# EAGLE schematic OASIS-Board (EAGLE 9.6.2)

## Sheet 1 of 2: Microcontroller
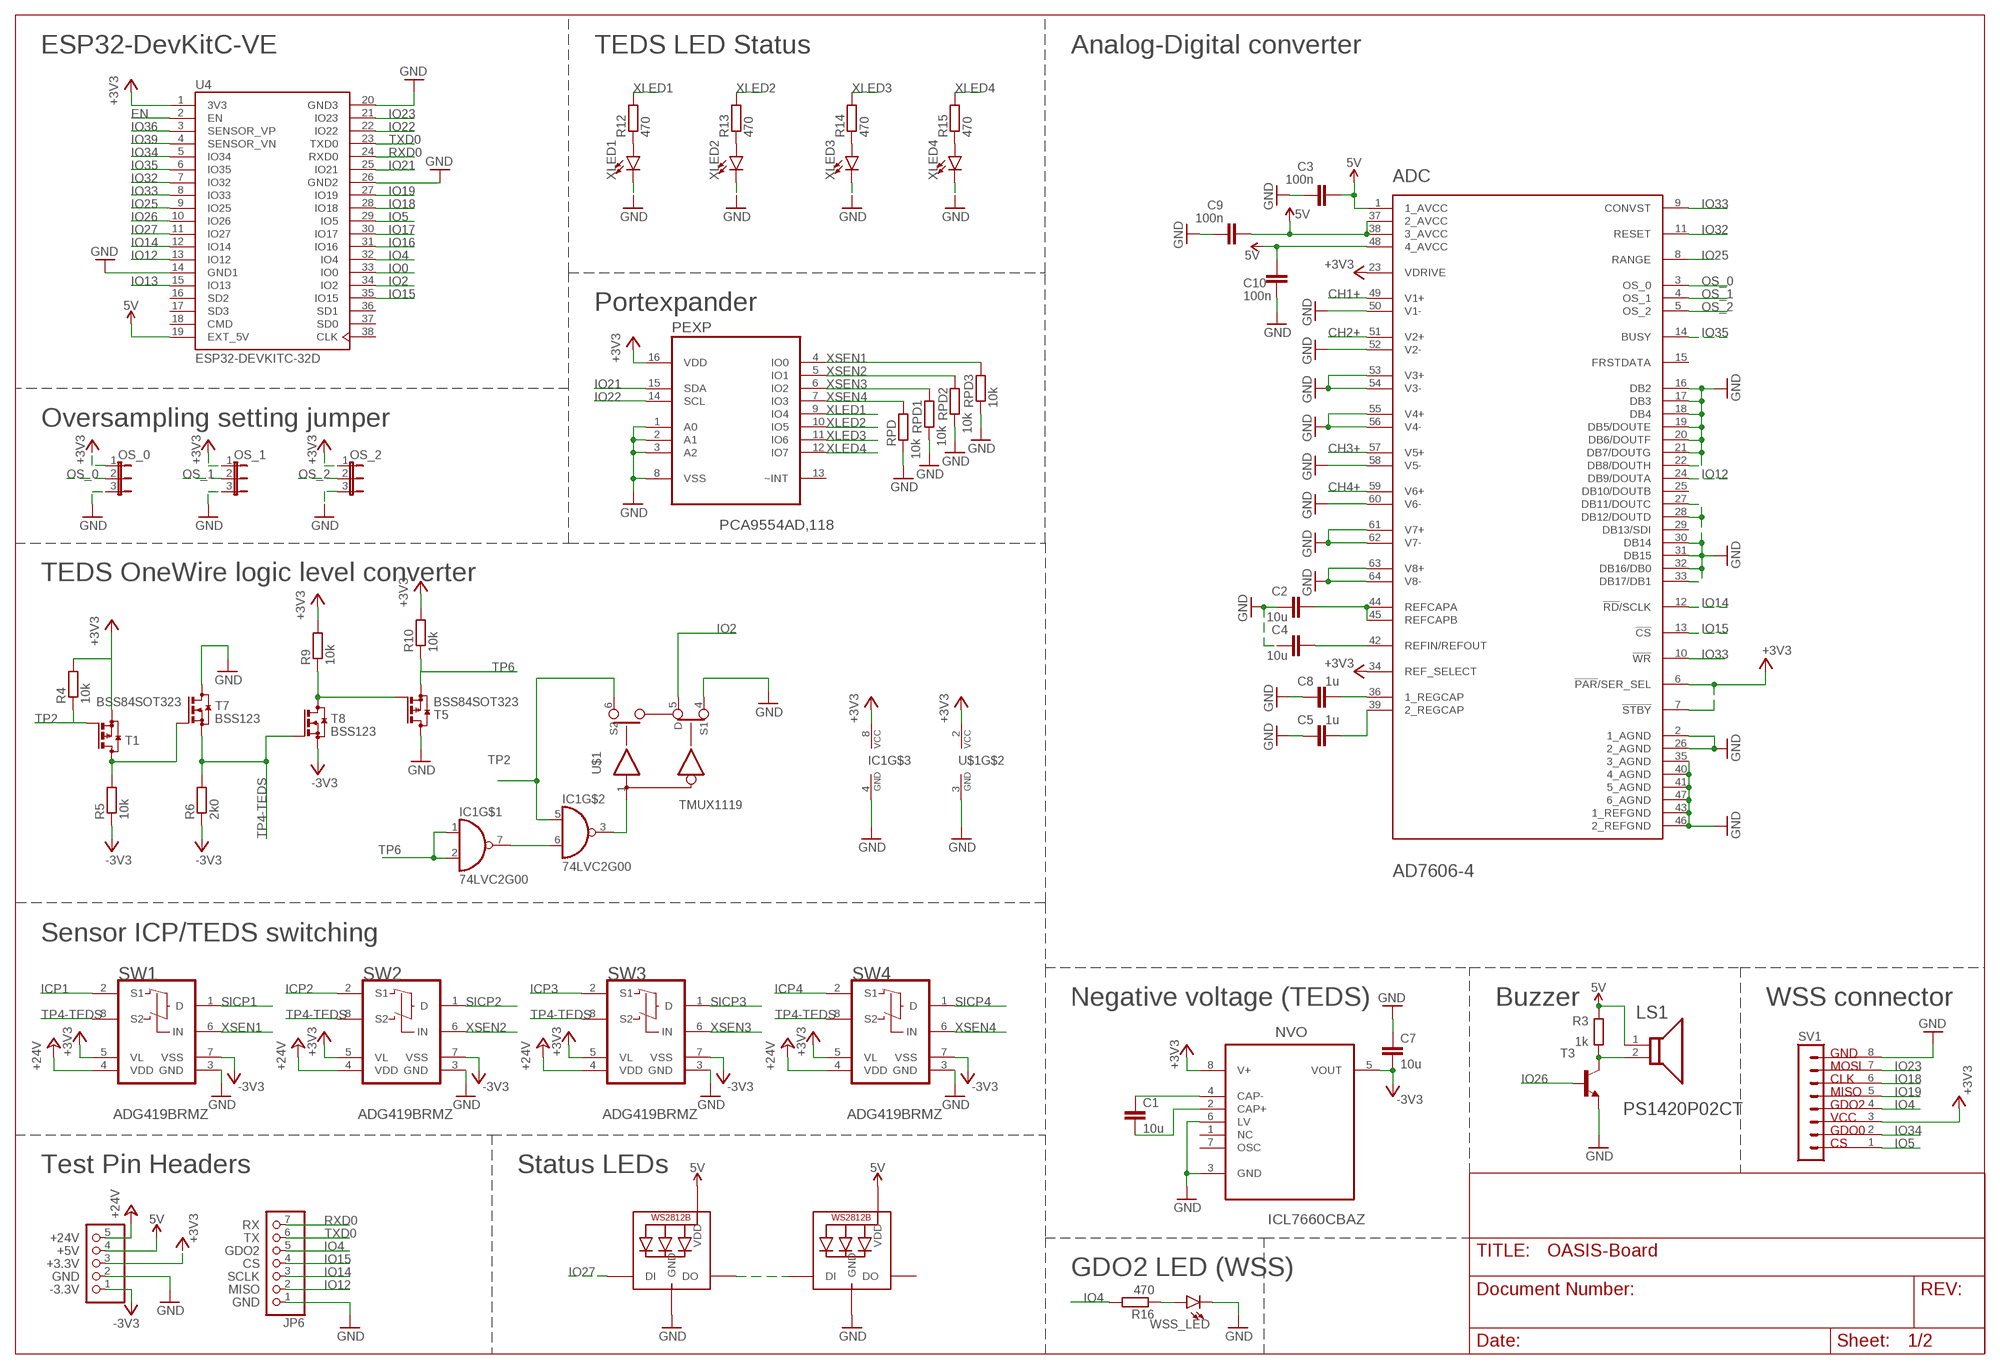
[diagram p0: schematic, sheet 1]

### Parts
ADC  ANALOG_DEVICES_AD7606-4ANALOG_DEVICES_AD7606-4_0_0  [ANALOG_DEVICES_AD7606-4_0]
C1  10u  C-EUC0603  [C0603]
C2  10u  C-EUC0603  [C0603]
C3  100n  C-EUC0603  [C0603]
C4  10u  C-EUC0603  [C0603]
C5  1u  C-EUC0603  [C0603]
C7  10u  C-EUC0603  [C0603]
C8  1u  C-EUC0603  [C0603]
C9  100n  C-EUC0603  [C0603]
C10  100n  C-EUC0603  [C0603]
IC1  74LVC2G00  [TEXAS_INSTRUMENTS_SN74LVC2G00DCUT_2]
JP5  PINHD-1X5  [1X05]
JP6  PINHD-1X7  [1X07]
LS1  TDK_PS1420P02CTTDK_PS1420P02CT_0_0  [TDK_PS1420P02CT_0]
NVO  ICL7660CBAZ  [SOIC127P600X175-8N]
OS_0  JP2E  [JP2]
OS_1  JP2E  [JP2]
OS_2  JP2E  [JP2]
PEXP  PCA9554AD,118  [SOIC127P1032X265-16N]
R3  1k  R-EU_R0603  [R0603]
R4  10k  R-EU_R0603_MAYR  [R0603_MAYR]
R5  10k  R-EU_R0603_MAYR  [R0603_MAYR]
R6  2k0  R-EU_R0603_MAYR  [R0603_MAYR]
R9  10k  R-EU_R0603_MAYR  [R0603_MAYR]
R10  10k  R-EU_R0603_MAYR  [R0603_MAYR]
R12  470  R-EU_R0603  [R0603]
R13  470  R-EU_R0603  [R0603]
R14  470  R-EU_R0603  [R0603]
R15  470  R-EU_R0603  [R0603]
R16  470  R-EU_R0603  [R0603]
RPD  10k  R-EU_R0603  [R0603]
RPD1  10k  R-EU_R0603  [R0603]
RPD2  10k  R-EU_R0603  [R0603]
RPD3  10k  R-EU_R0603  [R0603]
STATUS  WS2812B5050  [WS2812B]
SV1  MA08-1  [MA08-1]
SW1  ANALOG_DEVICES_ADG419BRMZANALOG_DEVICES_ADG419BRMZ_0_0  [ANALOG_DEVICES_ADG419BRMZ_0]
SW2  ANALOG_DEVICES_ADG419BRMZANALOG_DEVICES_ADG419BRMZ_0_0  [ANALOG_DEVICES_ADG419BRMZ_0]
SW3  ANALOG_DEVICES_ADG419BRMZANALOG_DEVICES_ADG419BRMZ_0_0  [ANALOG_DEVICES_ADG419BRMZ_0]
SW4  ANALOG_DEVICES_ADG419BRMZANALOG_DEVICES_ADG419BRMZ_0_0  [ANALOG_DEVICES_ADG419BRMZ_0]
T1  BSS84SOT323  [SOT323]
T3  BCF32-NPN-SOT23-BEC  [SOT23-BEC]
T5  BSS84SOT323  [SOT323]
T7  BSS123  [SOT23]
T8  BSS123  [SOT23]
U4  ESP32-DEVKITC-32D  [MODULE_ESP32-DEVKITC-32D]
U$1  TMUX1119  [TEXAS_INSTRUMENTS_TMUX1119DCKR_3]
WLAN  WS2812B5050  [WS2812B]
WSS_LED  LED0603  [LED-0603]
XLED1  LED0603  [LED-0603]
XLED2  LED0603  [LED-0603]
XLED3  LED0603  [LED-0603]
XLED4  LED0603  [LED-0603]

### Nets
5V: ADC.1(1_AVCC) ADC.37(2_AVCC) ADC.38(3_AVCC) ADC.48(4_AVCC) C3.2 C9.2 C10.2 JP5.4 LS1.1 R3.2 STATUS.1-VDD(VDD) U4.19(EXT_5V) WLAN.1-VDD(VDD) ; also sheet 2
+3V3: ADC.6(!PAR!/SER_SEL) ADC.7(!STBY!) ADC.23(VDRIVE) ADC.34(REF_SELECT) IC1.8(VCC) JP5.3 NVO.8(V+) OS_0.1 OS_1.1 OS_2.1 PEXP.16(VDD) R4.2 R9.2 R10.2 SV1.3 SW1.5(VL) SW2.5(VL) SW3.5(VL) SW4.5(VL) T1.3(S) U4.1(3V3) U$1.2(VCC)
+24V: JP5.5 SW1.4(VDD) SW2.4(VDD) SW3.4(VDD) SW4.4(VDD) ; also sheet 2
CH1+: ADC.49(V1+) ; also sheet 2
CH2+: ADC.51(V2+) ; also sheet 2
CH3+: ADC.57(V5+) ; also sheet 2
CH4+: ADC.59(V6+) ; also sheet 2
EN: U4.2(EN)
GND [gnd]: ADC.2(1_AGND) ADC.16(DB2) ADC.17(DB3) ADC.18(DB4) ADC.19(DB5/DOUTE) ADC.20(DB6/DOUTF) ADC.21(DB7/DOUTG) ADC.22(DB8/DOUTH) ADC.26(2_AGND) ADC.27(DB11/DOUTC) ADC.28(DB12/DOUTD) ADC.30(DB14) ADC.31(DB15) ADC.32(DB16/DB0) ADC.33(DB17/DB1) ADC.35(3_AGND) ADC.40(4_AGND) ADC.41(5_AGND) ADC.43(1_REFGND) ADC.46(2_REFGND) ADC.47(6_AGND) ADC.50(V1-) ADC.52(V2-) ADC.53(V3+) ADC.54(V3-) ADC.55(V4+) ADC.56(V4-) ADC.58(V5-) ADC.60(V6-) ADC.61(V7+) ADC.62(V7-) ADC.63(V8+) ADC.64(V8-) C2.1 C3.1 C4.1 C5.1 C7.1 C8.1 C9.1 C10.1 IC1.4(GND) JP5.2 JP6.1 NVO.3(GND) NVO.6(LV) OS_0.3 OS_1.3 OS_2.3 PEXP.1(A0) PEXP.2(A1) PEXP.3(A2) PEXP.8(VSS) RPD1.1 RPD2.1 RPD3.1 RPD.1 STATUS.3-GND(GND) SV1.8 SW1.3(GND) SW2.3(GND) SW3.3(GND) SW4.3(GND) T3.E T5.1(D) T7.3(D) U4.14(GND1) U4.20(GND3) U4.26(GND2) U$1.3(GND) U$1.4(S1) WLAN.3-GND(GND) WSS_LED.C XLED1.C XLED2.C XLED3.C XLED4.C ; also sheet 2
ICP1: SW1.2(S1) ; also sheet 2
ICP2: SW2.2(S1) ; also sheet 2
ICP3: SW3.2(S1) ; also sheet 2
ICP4: SW4.2(S1) ; also sheet 2
IO0: U4.33(IO0)
IO2: U4.34(IO2) U$1.5(D)
IO4: JP6.5 R16.2 SV1.4 U4.32(IO4)
IO5: SV1.1 U4.29(IO5)
IO12: ADC.24(DB9/DOUTA) JP6.2 U4.13(IO12)
IO13: U4.15(IO13)
IO14: ADC.12(!RD!/SCLK) JP6.3 U4.12(IO14)
IO15: ADC.13(!CS!) JP6.4 U4.35(IO15)
IO16: U4.31(IO16)
IO17: U4.30(IO17)
IO18: SV1.6 U4.28(IO18)
IO19: SV1.5 U4.27(IO19)
IO21: PEXP.15(SDA) U4.25(IO21)
IO22: PEXP.14(SCL) U4.22(IO22)
IO23: SV1.7 U4.21(IO23)
IO25: ADC.8(RANGE) U4.9(IO25)
IO26: T3.B U4.10(IO26)
IO27: STATUS.4-DIN(DI) U4.11(IO27)
IO32: ADC.11(RESET) U4.7(IO32)
IO33: ADC.9(CONVST) ADC.10(!WR!) U4.8(IO33)
IO34: SV1.2 U4.5(IO34)
IO35: ADC.14(BUSY) U4.6(IO35)
IO36: U4.3(SENSOR_VP)
IO39: U4.4(SENSOR_VN)
N$3: R16.1 WSS_LED.A
N$4: LS1.2 R3.1 T3.C
N$5: ADC.36(1_REGCAP) C8.2
N$6: STATUS.2-DOUT(DO) WLAN.4-DIN(DI)
N$7: C1.1 NVO.4(CAP-)
N$10: ADC.44(REFCAPA) ADC.45(REFCAPB) C2.2
N$11: R9.1 T5.2(G) T8.3(D)
N$12: IC1.3(O) U$1.1(IN)
N$13: ADC.39(2_REGCAP) C5.2
N$20: IC1.6(I1) IC1.7(O)
N$21: R5.2 T1.1(D) T7.1(G)
N$22: C1.2 NVO.2(CAP+)
N$23: R12.1 XLED1.A
N$24: R13.1 XLED2.A
N$30: ADC.42(REFIN/REFOUT) C4.2
N$33: R14.1 XLED3.A
N$36: R15.1 XLED4.A
OS_0: ADC.3(OS_0) OS_0.2
OS_1: ADC.4(OS_1) OS_1.2
OS_2: ADC.5(OS_2) OS_2.2
RXD0: JP6.7 U4.24(RXD0)
SICP1: SW1.1(D) ; also sheet 2
SICP2: SW2.1(D) ; also sheet 2
SICP3: SW3.1(D) ; also sheet 2
SICP4: SW4.1(D) ; also sheet 2
TP2: IC1.5(I0) R4.1 T1.2(G) U$1.6(S2)
TP4-TEDS: R6.2 SW1.8(S2) SW2.8(S2) SW3.8(S2) SW4.8(S2) T7.2(S) T8.1(G)
TP6: IC1.1(I0) IC1.2(I1) R10.1 T5.3(S)
TXD0: JP6.6 U4.23(TXD0)
V-: C7.2 JP5.1 NVO.5(VOUT) R5.1 R6.1 SW1.7(VSS) SW2.7(VSS) SW3.7(VSS) SW4.7(VSS) T8.2(S) ; supply symbol labelled -3V3
XLED1: PEXP.9(IO4) R12.2
XLED2: PEXP.10(IO5) R13.2
XLED3: PEXP.11(IO6) R14.2
XLED4: PEXP.12(IO7) R15.2
XSEN1: PEXP.4(IO0) RPD3.2 SW1.6(IN)
XSEN2: PEXP.5(IO1) RPD2.2 SW2.6(IN)
XSEN3: PEXP.6(IO2) RPD1.2 SW3.6(IN)
XSEN4: PEXP.7(IO3) RPD.2 SW4.6(IN)
Unconnected: ADC.15(FRSTDATA) ADC.25(DB10/DOUTB) ADC.29(DB13/SDI) NVO.1(NC) NVO.7(OSC) PEXP.13(~INT) U4.16(SD2) U4.17(SD3) U4.18(CMD) U4.36(SD1) U4.37(SD0) U4.38(CLK) WLAN.2-DOUT(DO)

### Notes on the sheet
- ESP32-DevKitC-VE | TEDS LED Status | Analog-Digital converter
- Portexpander
- Oversampling setting jumper
- TEDS OneWire logic level converter
- Sensor ICP/TEDS switching
- Negative voltage (TEDS) | Buzzer | WSS connector
- Test Pin Headers | Status LEDs
- GDO2 LED (WSS)

## Sheet 2 of 2: IEPE-Modul
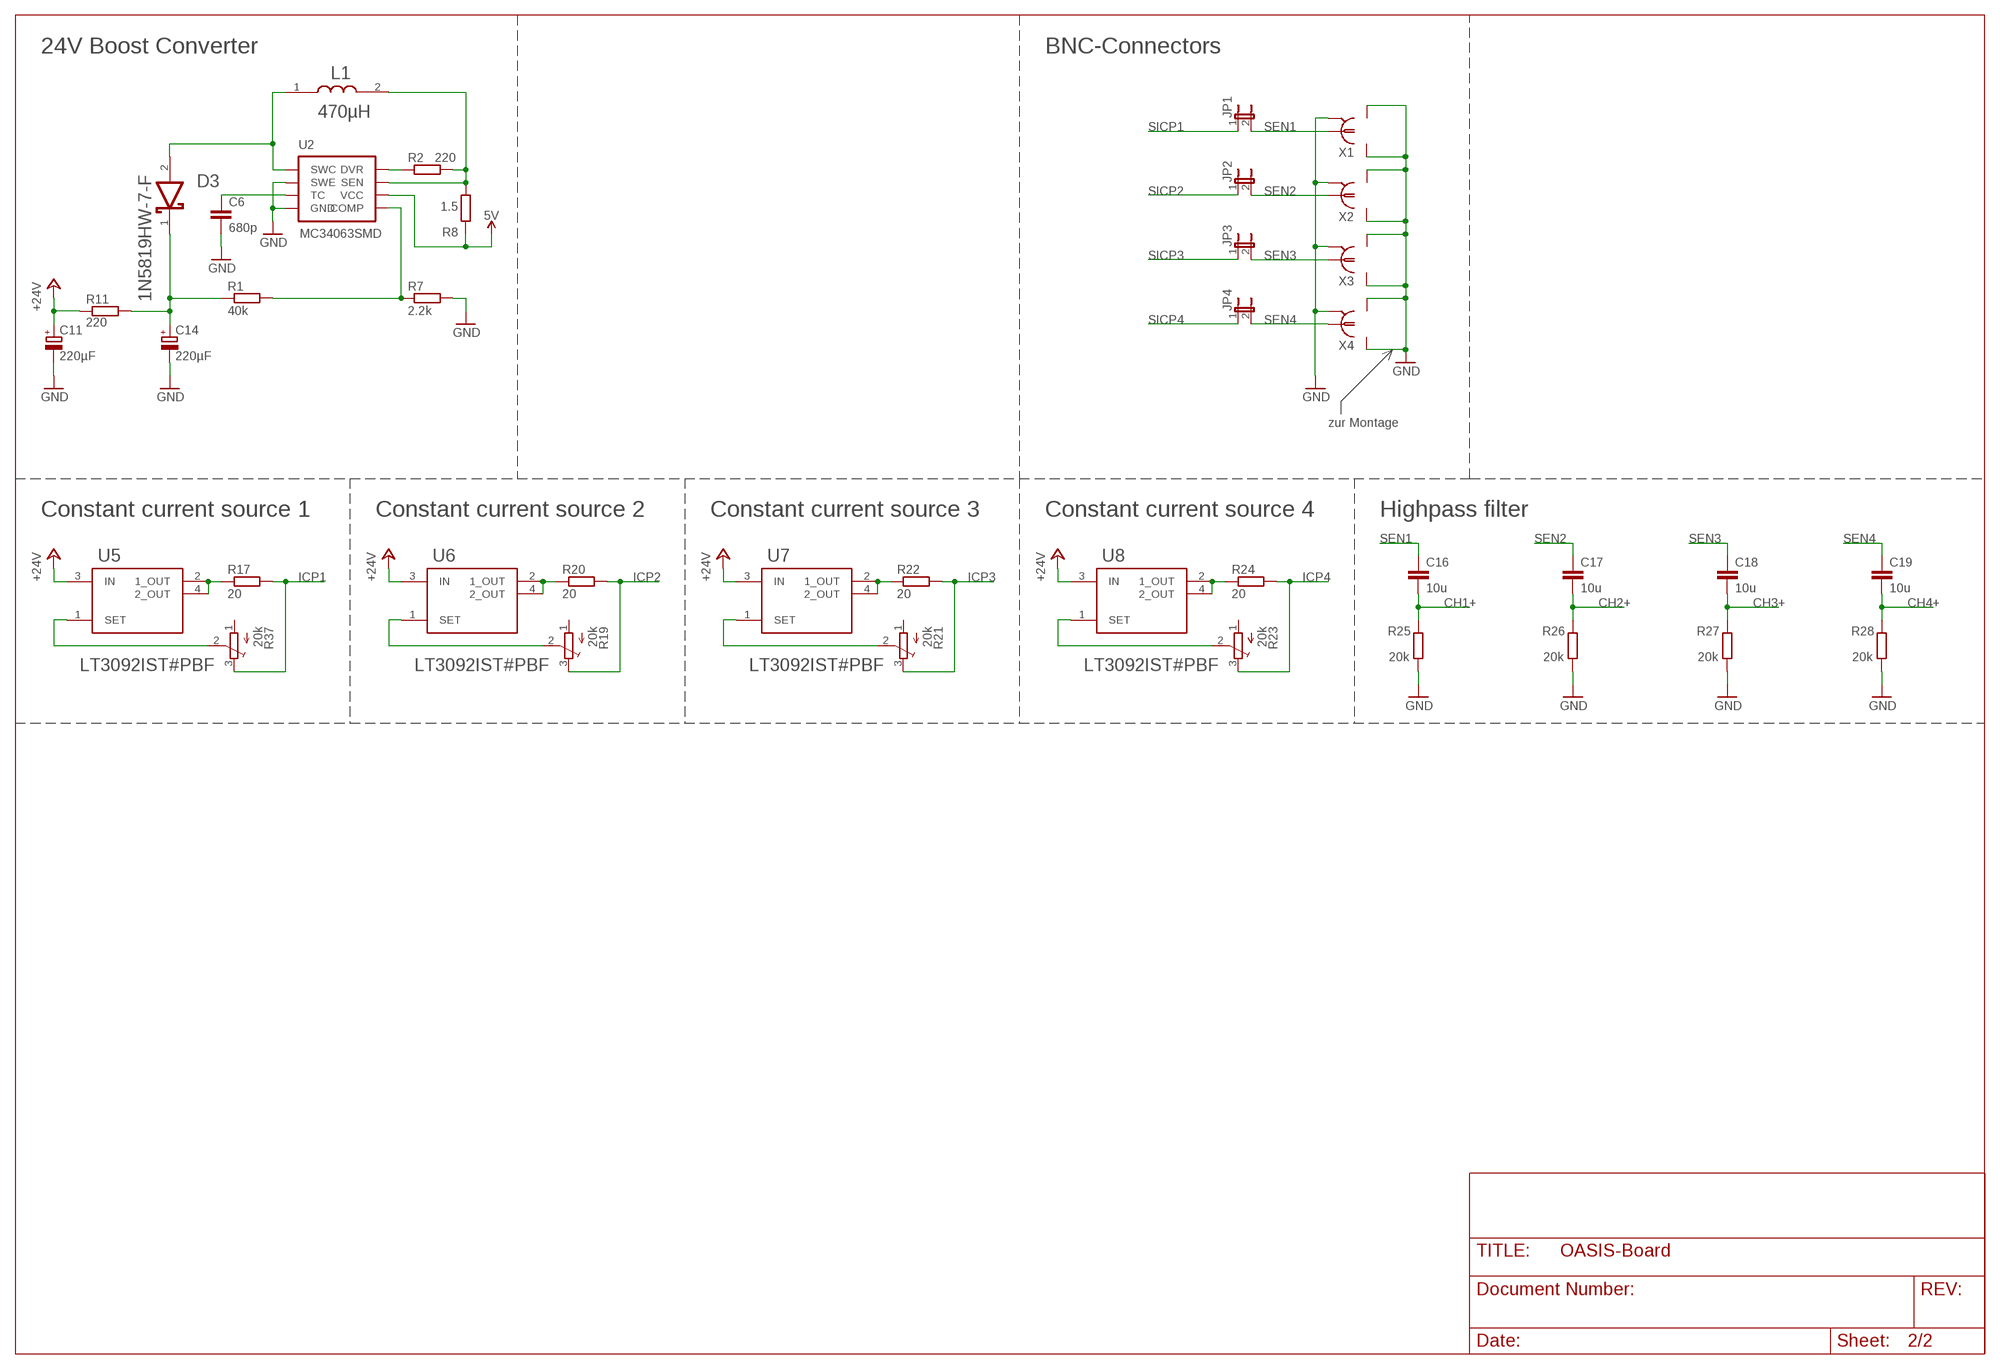
[diagram p1: schematic, sheet 2]

### Parts
C6  680p  C-EUC0603  [C0603]
C11  220µF  CPOL-EU153CLV-1012  [153CLV-1012]
C14  220µF  CPOL-EU153CLV-1012  [153CLV-1012]
C16  10u  C-EUC0603  [C0603]
C17  10u  C-EUC0603  [C0603]
C18  10u  C-EUC0603  [C0603]
C19  10u  C-EUC0603  [C0603]
D3  DIODES_1N5819HW-7-FDIODES_1N5819HW-7-F_0_1  [DIODES_1N5819HW-7-F_1]
JP1  JP1E  [JP1]
JP2  JP1E  [JP1]
JP3  JP1E  [JP1]
JP4  JP1E  [JP1]
L1  BOURNS_SRR1260-470MBOURNS_SRR1260-470M_0_0  [BOURNS_SRR1260-470M_0]
R1  40k  R-EU_R0603  [R0603]
R2  220  R-EU_R0603  [R0603]
R7  2.2k  R-EU_R0603  [R0603]
R8  1.5  R-EU_R0603  [R0603]
R11  220  R-EU_R0603  [R0603]
R17  20  R-EU_R0603  [R0603]
R19  20k  TRIM_EU-SM-42/43W  [SM-42/43W]
R20  20  R-EU_R0603  [R0603]
R21  20k  TRIM_EU-SM-42/43W  [SM-42/43W]
R22  20  R-EU_R0603  [R0603]
R23  20k  TRIM_EU-SM-42/43W  [SM-42/43W]
R24  20  R-EU_R0603  [R0603]
R25  20k  R-EU_R0603  [R0603]
R26  20k  R-EU_R0603  [R0603]
R27  20k  R-EU_R0603  [R0603]
R28  20k  R-EU_R0603  [R0603]
R37  20k  TRIM_EU-SM-42/43W  [SM-42/43W]
U2  MC34063SMD  [SO08]
U5  ANALOG_DEVICES_INC_LT3092IST#PBFANALOG_DEVICES_INC_LT3092IST#PBF_0_0  [ANALOG_DEVICES_INC_LT3092IST#PBF_0]
U6  ANALOG_DEVICES_INC_LT3092IST#PBFANALOG_DEVICES_INC_LT3092IST#PBF_0_0  [ANALOG_DEVICES_INC_LT3092IST#PBF_0]
U7  ANALOG_DEVICES_INC_LT3092IST#PBFANALOG_DEVICES_INC_LT3092IST#PBF_0_0  [ANALOG_DEVICES_INC_LT3092IST#PBF_0]
U8  ANALOG_DEVICES_INC_LT3092IST#PBFANALOG_DEVICES_INC_LT3092IST#PBF_0_0  [ANALOG_DEVICES_INC_LT3092IST#PBF_0]
X1  BNC  [AMP_227161]
X2  BNC  [AMP_227161]
X3  BNC  [AMP_227161]
X4  BNC  [AMP_227161]

### Nets
5V: R8.1 U2.6(VCC) ; also sheet 1
+24V: C11.+ R11.1 U5.3(IN) U6.3(IN) U7.3(IN) U8.3(IN) ; also sheet 1
CH1+: C16.2 R25.2 ; also sheet 1
CH2+: C17.2 R26.2 ; also sheet 1
CH3+: C18.2 R27.2 ; also sheet 1
CH4+: C19.2 R28.2 ; also sheet 1
GND [gnd]: C6.2 C11.- C14.- R7.2 R25.1 R26.1 R27.1 R28.1 U2.2(SWE) U2.4(GND) X1.2 X1.P$1 X1.P$2 X2.2 X2.P$1 X2.P$2 X3.2 X3.P$1 X3.P$2 X4.2 X4.P$1 X4.P$2 ; also sheet 1
ICP1: R17.2 R37.3(E) ; also sheet 1
ICP2: R19.3(E) R20.2 ; also sheet 1
ICP3: R21.3(E) R22.2 ; also sheet 1
ICP4: R23.3(E) R24.2 ; also sheet 1
N$14: D3.2(ANODE) L1.1 U2.1(SWC)
N$15: C6.1 U2.3(TC)
N$16: L1.2 R2.2 R8.2 U2.7(SEN)
N$17: R1.2 R7.1 U2.5(COMP)
N$18: R2.1 U2.8(DVR)
N$19: C14.+ D3.1(CATHODE) R1.1 R11.2
N$26: R17.1 U5.2(1_OUT) U5.4(2_OUT)
N$27: R37.2(S) U5.1(SET)
N$28: R20.1 U6.2(1_OUT) U6.4(2_OUT)
N$29: R19.2(S) U6.1(SET)
N$31: R22.1 U7.2(1_OUT) U7.4(2_OUT)
N$32: R21.2(S) U7.1(SET)
N$34: R24.1 U8.2(1_OUT) U8.4(2_OUT)
N$35: R23.2(S) U8.1(SET)
SEN1: C16.1 JP1.2 X1.1
SEN2: C17.1 JP2.2 X2.1
SEN3: C18.1 JP3.2 X3.1
SEN4: C19.1 JP4.2 X4.1
SICP1: JP1.1 ; also sheet 1
SICP2: JP2.1 ; also sheet 1
SICP3: JP3.1 ; also sheet 1
SICP4: JP4.1 ; also sheet 1
Unconnected: R19.1(A) R21.1(A) R23.1(A) R37.1(A)

### Notes on the sheet
- 24V Boost Converter | BNC-Connectors
- zur Montage
- Constant current source 1 | Constant current source 2 | Constant current source 3 | Constant current source 4 | Highpass filter

## Library data of the parts
ADC = AD7606-4:ANALOG_DEVICES_AD7606-4: 18 Bit Analog to Digital Converter 8 Input 1 SAR 64-LQFP (10x10); AUTOMOTIVE: No; CENTROID_NOT_SPECIFIED: No; DATASHEET: https://www.analog.com/media/en/technical-documentation/data-sheets/ad7606c-18.pdf; DATA_POLARITY: Single Ended/Differential; DEVICE_CLASS_L1: Integrated Circuits (ICs); DEVICE_CLASS_L2: Data Converter ICs; DEVICE_CLASS_L3: Analog to Digital Converters (ADCs); DIGIKEY_DESCRIPTION: IC ADC 18BIT SAR 64LQFP; DIGIKEY_PART_NUMBER: 505-AD7606-4-ND; FOOTPRINT_PARAMETERS_0: {"fp_type":"MQFP","params":{"N1":{"nom":16,"long name":"Leads on long side","min":null,"max":null,"short name":"N1","type":"count"},"N2":{"nom":16,"long name":"Leads on wide side","min":null,"max":null,"short name":"N2","type":"count"},"A":{"nom":false,"long name":"Height","min":false,"max":1600000,"short name":"A","type":"measurement"},"A1":{"nom":100000,"long name":"Package clearance","min":50000,"max":150000,"short name":"A1","type":"measurement"},"A2":{"nom":1400000,"long name":"Package height","min":1350000,"max":1450000,"short name":"A2","type":"measurement"},"D":{"nom":12000000,"long name":"Length /w leads","min":11800000,"max":12200000,"short name":"D","type":"measurement"},"D1":{"nom":10000000,"long name":"Package length","min":9800000,"max":10200000,"short name":"D1","type":"measurement"},"E":{"nom":12000000,"long name":"Width /w leads","min":11800000,"max":12200000,"short name":"E","type":"measurement"},"E1":{"nom":10000000,"long name":"Package width","min":9800000,"max":10200000,"short name":"E1","type":"measurement"},"B":{"nom":220000,"long name":"Lead width","min":170000,"max":270000,"short name":"B","type":"measurement"},"C":{"nom":145000,"long name":"Lead thickness","min":90000,"max":200000,"short name":"C","type":"measurement"},"L":{"nom":600000,"long name":"Lead foot length","min":450000,"max":750000,"short name":"L","type":"measurement"},"e":{"nom":500000,"long name":"Lead pitch","min":null,"max":null,"short name":"e","type":"measurement"},"PHI":{"nom":35,"long name":"Lead angle","min":0,"max":70,"short name":"PHI","type":"measurement"},"HT":{"default":"No","long name":"Thermal pad","type":"multichoiceparent","short name":"HT","children":[]},"offset x":{"nom":0,"long name":"X Center offset","min":null,"max":null,"short name":"offset x","type":"measurement"},"offset y":{"nom":0,"long name":"Y Center offset","min":null,"max":null,"short name":"offset y","type":"measurement"},"LS":{"default":"Rounded rectangle","long name":"Land shape","type":"multichoice","short name":"LS"},"LS1":{"default":"Rectangle","long name":"Land shape (Pin 1)","type":"multichoice","short name":"LS1"},"solder toe":{"nom":550000,"long name":"Solder fillet (toe)","min":null,"max":null,"short name":"solder toe","type":"fixedmeasurement"},"solder heel":{"nom":450000,"long name":"Solder fillet (heel)","min":null,"max":null,"short name":"solder heel","type":"fixedmeasurement"},"solder side":{"nom":10000,"long name":"Solder fillet (side)","min":null,"max":null,"short name":"solder side","type":"fixedmeasurement"},"courtyard":{"nom":500000,"long name":"Courtyard","min":null,"max":null,"short name":"courtyard","type":"fixedmeasurement"},"SF":{"default":"A (<= 0.625mm pitch)","long name":"Packing level","type":"multichoiceparent","short name":"SF","help":"http://support.upverter.com/customer/portal/articles/978783-what-is-a-footprint-packing-level","children":["solder toe","solder heel","solder side","courtyard"]}}}; FOOTPRINT_PARAMETERS_1: {"fp_type":"MQFP","params":{"N1":{"nom":16,"long name":"Leads on long side","min":null,"max":null,"short name":"N1","type":"count"},"N2":{"nom":16,"long name":"Leads on wide side","min":null,"max":null,"short name":"N2","type":"count"},"A":{"nom":false,"long name":"Height","min":false,"max":1600000,"short name":"A","type":"measurement"},"A1":{"nom":100000,"long name":"Package clearance","min":50000,"max":150000,"short name":"A1","type":"measurement"},"A2":{"nom":1400000,"long name":"Package height","min":1350000,"max":1450000,"short name":"A2","type":"measurement"},"D":{"nom":12000000,"long name":"Length /w leads","min":11800000,"max":12200000,"short name":"D","type":"measurement"},"D1":{"nom":10000000,"long name":"Package length","min":9800000,"max":10200000,"short name":"D1","type":"measurement"},"E":{"nom":12000000,"long name":"Width /w leads","min":11800000,"max":12200000,"short name":"E","type":"measurement"},"E1":{"nom":10000000,"long name":"Package width","min":9800000,"max":10200000,"short name":"E1","type":"measurement"},"B":{"nom":220000,"long name":"Lead width","min":170000,"max":270000,"short name":"B","type":"measurement"},"C":{"nom":145000,"long name":"Lead thickness","min":90000,"max":200000,"short name":"C","type":"measurement"},"L":{"nom":600000,"long name":"Lead foot length","min":450000,"max":750000,"short name":"L","type":"measurement"},"e":{"nom":500000,"long name":"Lead pitch","min":null,"max":null,"short name":"e","type":"measurement"},"PHI":{"nom":35,"long name":"Lead angle","min":0,"max":70,"short name":"PHI","type":"measurement"},"HT":{"default":"No","long name":"Thermal pad","type":"multichoiceparent","short name":"HT","children":[]},"offset x":{"nom":0,"long name":"X Center offset","min":null,"max":null,"short name":"offset x","type":"measurement"},"offset y":{"nom":0,"long name":"Y Center offset","min":null,"max":null,"short name":"offset y","type":"measurement"},"LS":{"default":"Rounded rectangle","long name":"Land shape","type":"multichoice","short name":"LS"},"LS1":{"default":"Rectangle","long name":"Land shape (Pin 1)","type":"multichoice","short name":"LS1"},"solder toe":{"nom":350000,"long name":"Solder fillet (toe)","min":null,"max":null,"short name":"solder toe","type":"fixedmeasurement"},"solder heel":{"nom":350000,"long name":"Solder fillet (heel)","min":null,"max":null,"short name":"solder heel","type":"fixedmeasurement"},"solder side":{"nom":-20000,"long name":"Solder fillet (side)","min":null,"max":null,"short name":"solder side","type":"fixedmeasurement"},"courtyard":{"nom":250000,"long name":"Courtyard","min":null,"max":null,"short name":"courtyard","type":"fixedmeasurement"},"SF":{"default":"B (<= 0.625mm pitch)","long name":"Packing level","type":"multichoiceparent","short name":"SF","help":"http://support.upverter.com/customer/portal/articles/978783-what-is-a-footprint-packing-level","children":["solder toe","solder heel","solder side","courtyard"]}}}; FOOTPRINT_PARAMETERS_2: {"fp_type":"MQFP","params":{"N1":{"nom":16,"long name":"Leads on long side","min":null,"max":null,"short name":"N1","type":"count"},"N2":{"nom":16,"long name":"Leads on wide side","min":null,"max":null,"short name":"N2","type":"count"},"A":{"nom":false,"long name":"Height","min":false,"max":1600000,"short name":"A","type":"measurement"},"A1":{"nom":100000,"long name":"Package clearance","min":50000,"max":150000,"short name":"A1","type":"measurement"},"A2":{"nom":1400000,"long name":"Package height","min":1350000,"max":1450000,"short name":"A2","type":"measurement"},"D":{"nom":12000000,"long name":"Length /w leads","min":11800000,"max":12200000,"short name":"D","type":"measurement"},"D1":{"nom":10000000,"long name":"Package length","min":9800000,"max":10200000,"short name":"D1","type":"measurement"},"E":{"nom":12000000,"long name":"Width /w leads","min":11800000,"max":12200000,"short name":"E","type":"measurement"},"E1":{"nom":10000000,"long name":"Package width","min":9800000,"max":10200000,"short name":"E1","type":"measurement"},"B":{"nom":220000,"long name":"Lead width","min":170000,"max":270000,"short name":"B","type":"measurement"},"C":{"nom":145000,"long name":"Lead thickness","min":90000,"max":200000,"short name":"C","type":"measurement"},"L":{"nom":600000,"long name":"Lead foot length","min":450000,"max":750000,"short name":"L","type":"measurement"},"e":{"nom":500000,"long name":"Lead pitch","min":null,"max":null,"short name":"e","type":"measurement"},"PHI":{"nom":35,"long name":"Lead angle","min":0,"max":70,"short name":"PHI","type":"measurement"},"HT":{"default":"No","long name":"Thermal pad","type":"multichoiceparent","short name":"HT","children":[]},"offset x":{"nom":0,"long name":"X Center offset","min":null,"max":null,"short name":"offset x","type":"measurement"},"offset y":{"nom":0,"long name":"Y Center offset","min":null,"max":null,"short name":"offset y","type":"measurement"},"LS":{"default":"Rounded rectangle","long name":"Land shape","type":"multichoice","short name":"LS"},"LS1":{"default":"Rectangle","long name":"Land shape (Pin 1)","type":"multichoice","short name":"LS1"},"solder toe":{"nom":150000,"long name":"Solder fillet (toe)","min":null,"max":null,"short name":"solder toe","type":"fixedmeasurement"},"solder heel":{"nom":250000,"long name":"Solder fillet (heel)","min":null,"max":null,"short name":"solder heel","type":"fixedmeasurement"},"solder side":{"nom":-40000,"long name":"Solder fillet (side)","min":null,"max":null,"short name":"solder side","type":"fixedmeasurement"},"courtyard":{"nom":100000,"long name":"Courtyard","min":null,"max":null,"short name":"courtyard","type":"fixedmeasurement"},"SF":{"default":"C (<= 0.625mm pitch)","long name":"Packing level","type":"multichoiceparent","short name":"SF","help":"http://support.upverter.com/customer/portal/articles/978783-what-is-a-footprint-packing-level","children":["solder toe","solder heel","solder side","courtyard"]}}}; FOOTPRINT_URL: https://www.analog.com/media/en/package-pcb-resources/package/pkg_pdf/lqfpst/st_64_2.pdf; FOOTPRINT_VARIANT_NAME_0: IPC_A; FOOTPRINT_VARIANT_NAME_1: IPC_B; FOOTPRINT_VARIANT_NAME_2: IPC_C; HEIGHT: 1.6mm; INTERFACE: SPI,Parallel; LEAD_FREE: Yes; MAX_JUNCTION_TEMP: +150°C; MAX_SUPPLY_VOLTAGE: 5.25V; MF: Analog Devices; MFG_PACKAGE_IDENT: ST-64-2; MFG_PACKAGE_IDENT_COMPONENT_ID: 9cd505c2a9c114eb; MFG_PACKAGE_IDENT_DATE: 05/2006; MFG_PACKAGE_IDENT_REV: A; MIN_SUPPLY_VOLTAGE: 1.71V; MOUSER_PART_NUMBER: 584-AD7606-4; MPN: AD7606-4; NOMINAL_SUPPLY_CURRENT: 8-45mA; NUMBER_OF_CHANNELS: 8; NUMBER_OF_CONVERTERS: 1; PACKAGE: LQFP64; PREFIX: U; RESOLUTION: 18bits; ROHS: Yes; SAMPLING_RATE: 1Msps; STANDOFF_HEIGHT: 0.05mm; TEMPERATURE_RANGE_HIGH: +125°C; TEMPERATURE_RANGE_LOW: -40°C; VERIFICATION_VERSION: 0.0.0.3
C1-C10 C16-C19 = rcl:C-EU: CAPACITOR, European symbol; SPICEPREFIX: C
C11 C14 = rcl:CPOL-EU: POLARIZED CAPACITOR, European symbol; SPICEPREFIX: C
D3 = Diodes - 1N5819HW-7-F:DIODES_1N5819HW-7-F: Diode Schottky 40V 1A Surface Mount SOD-123; AUTOMOTIVE: No; CAPACITANCE: 50pF; CENTROID_NOT_SPECIFIED: No; DATASHEET: https://www.diodes.com/assets/Datasheets/ds30217.pdf; DEVICE_CLASS_L1: Discrete Semiconductors; DEVICE_CLASS_L2: Diodes; DEVICE_CLASS_L3: Schottky Diodes; DIGIKEY_DESCRIPTION: DIODE SCHOTTKY 40V 1A SOD123; DIGIKEY_PART_NUMBER: 1N5819HW-FDICT-ND; FOOTPRINT_PARAMETERS_1: {"fp_type":"SOD123","params":{"N":{"long name":"Number of leads","type":"fixed","short name":"N","value":2},"A":{"nom":1100000,"long name":"Height","min":1000000,"max":1450000,"short name":"A","type":"measurement"},"A1":{"nom":50000,"long name":"Package clearance","min":0,"max":100000,"short name":"A1","type":"measurement"},"A2":{"nom":false,"long name":"Package height","min":false,"max":1450000,"short name":"A2","type":"measurement"},"D":{"nom":3650000,"long name":"Length /w leads","min":3550000,"max":3850000,"short name":"D","type":"measurement"},"D1":{"nom":2650000,"long name":"Package length","min":2550000,"max":2850000,"short name":"D1","type":"measurement"},"E":{"nom":1550000,"long name":"Package width","min":1400000,"max":1700000,"short name":"E","type":"measurement"},"B":{"nom":570000,"long name":"Lead width","min":520000,"max":620000,"short name":"B","type":"measurement"},"C":{"nom":110000,"long name":"Lead thickness","min":100000,"max":150000,"short name":"C","type":"measurement"},"L":{"nom":300000,"long name":"Lead foot length","min":250000,"max":400000,"short name":"L","type":"measurement"},"PHI":{"nom":false,"long name":"Lead angle","min":0,"max":8000000,"short name":"PHI","type":"measurement"},"offset x":{"nom":0,"long name":"X Center offset","min":null,"max":null,"short name":"offset x","type":"measurement"},"offset y":{"nom":0,"long name":"Y Center offset","min":null,"max":null,"short name":"offset y","type":"measurement"},"LS":{"default":"Rounded rectangle","long name":"Land shape","type":"multichoice","short name":"LS"},"LS1":{"default":"Rectangle","long name":"Land shape (Pin 1)","type":"multichoice","short name":"LS1"},"solder toe":{"nom":550000,"long name":"Solder fillet (toe)","min":null,"max":null,"short name":"solder toe","type":"fixedmeasurement"},"solder heel":{"nom":450000,"long name":"Solder fillet (heel)","min":null,"max":null,"short name":"solder heel","type":"fixedmeasurement"},"solder side":{"nom":50000,"long name":"Solder fillet (side)","min":null,"max":null,"short name":"solder side","type":"fixedmeasurement"},"courtyard":{"nom":500000,"long name":"Courtyard","min":null,"max":null,"short name":"courtyard","type":"fixedmeasurement"},"SF":{"default":"A","long name":"Packing level","type":"multichoiceparent","short name":"SF","help":"http://support.upverter.com/customer/portal/articles/978783-what-is-a-footprint-packing-level","children":["solder toe","solder heel","solder side","courtyard"]}}}; FOOTPRINT_PARAMETERS_2: {"fp_type":"SOD123","params":{"N":{"long name":"Number of leads","type":"fixed","short name":"N","value":2},"A":{"nom":1100000,"long name":"Height","min":1000000,"max":1450000,"short name":"A","type":"measurement"},"A1":{"nom":50000,"long name":"Package clearance","min":0,"max":100000,"short name":"A1","type":"measurement"},"A2":{"nom":false,"long name":"Package height","min":false,"max":1450000,"short name":"A2","type":"measurement"},"D":{"nom":3650000,"long name":"Length /w leads","min":3550000,"max":3850000,"short name":"D","type":"measurement"},"D1":{"nom":2650000,"long name":"Package length","min":2550000,"max":2850000,"short name":"D1","type":"measurement"},"E":{"nom":1550000,"long name":"Package width","min":1400000,"max":1700000,"short name":"E","type":"measurement"},"B":{"nom":570000,"long name":"Lead width","min":520000,"max":620000,"short name":"B","type":"measurement"},"C":{"nom":110000,"long name":"Lead thickness","min":100000,"max":150000,"short name":"C","type":"measurement"},"L":{"nom":300000,"long name":"Lead foot length","min":250000,"max":400000,"short name":"L","type":"measurement"},"PHI":{"nom":false,"long name":"Lead angle","min":0,"max":8000000,"short name":"PHI","type":"measurement"},"offset x":{"nom":0,"long name":"X Center offset","min":null,"max":null,"short name":"offset x","type":"measurement"},"offset y":{"nom":0,"long name":"Y Center offset","min":null,"max":null,"short name":"offset y","type":"measurement"},"LS":{"default":"Rounded rectangle","long name":"Land shape","type":"multichoice","short name":"LS"},"LS1":{"default":"Rectangle","long name":"Land shape (Pin 1)","type":"multichoice","short name":"LS1"},"solder toe":{"nom":350000,"long name":"Solder fillet (toe)","min":null,"max":null,"short name":"solder toe","type":"fixedmeasurement"},"solder heel":{"nom":350000,"long name":"Solder fillet (heel)","min":null,"max":null,"short name":"solder heel","type":"fixedmeasurement"},"solder side":{"nom":30000,"long name":"Solder fillet (side)","min":null,"max":null,"short name":"solder side","type":"fixedmeasurement"},"courtyard":{"nom":250000,"long name":"Courtyard","min":null,"max":null,"short name":"courtyard","type":"fixedmeasurement"},"SF":{"default":"B","long name":"Packing level","type":"multichoiceparent","short name":"SF","help":"http://support.upverter.com/customer/portal/articles/978783-what-is-a-footprint-packing-level","children":["solder toe","solder heel","solder side","courtyard"]}}}; FOOTPRINT_PARAMETERS_3: {"fp_type":"SOD123","params":{"N":{"long name":"Number of leads","type":"fixed","short name":"N","value":2},"A":{"nom":1100000,"long name":"Height","min":1000000,"max":1450000,"short name":"A","type":"measurement"},"A1":{"nom":50000,"long name":"Package clearance","min":0,"max":100000,"short name":"A1","type":"measurement"},"A2":{"nom":false,"long name":"Package height","min":false,"max":1450000,"short name":"A2","type":"measurement"},"D":{"nom":3650000,"long name":"Length /w leads","min":3550000,"max":3850000,"short name":"D","type":"measurement"},"D1":{"nom":2650000,"long name":"Package length","min":2550000,"max":2850000,"short name":"D1","type":"measurement"},"E":{"nom":1550000,"long name":"Package width","min":1400000,"max":1700000,"short name":"E","type":"measurement"},"B":{"nom":570000,"long name":"Lead width","min":520000,"max":620000,"short name":"B","type":"measurement"},"C":{"nom":110000,"long name":"Lead thickness","min":100000,"max":150000,"short name":"C","type":"measurement"},"L":{"nom":300000,"long name":"Lead foot length","min":250000,"max":400000,"short name":"L","type":"measurement"},"PHI":{"nom":false,"long name":"Lead angle","min":0,"max":8000000,"short name":"PHI","type":"measurement"},"offset x":{"nom":0,"long name":"X Center offset","min":null,"max":null,"short name":"offset x","type":"measurement"},"offset y":{"nom":0,"long name":"Y Center offset","min":null,"max":null,"short name":"offset y","type":"measurement"},"LS":{"default":"Rounded rectangle","long name":"Land shape","type":"multichoice","short name":"LS"},"LS1":{"default":"Rectangle","long name":"Land shape (Pin 1)","type":"multichoice","short name":"LS1"},"solder toe":{"nom":150000,"long name":"Solder fillet (toe)","min":null,"max":null,"short name":"solder toe","type":"fixedmeasurement"},"solder heel":{"nom":250000,"long name":"Solder fillet (heel)","min":null,"max":null,"short name":"solder heel","type":"fixedmeasurement"},"solder side":{"nom":10000,"long name":"Solder fillet (side)","min":null,"max":null,"short name":"solder side","type":"fixedmeasurement"},"courtyard":{"nom":100000,"long name":"Courtyard","min":null,"max":null,"short name":"courtyard","type":"fixedmeasurement"},"SF":{"default":"C","long name":"Packing level","type":"multichoiceparent","short name":"SF","help":"http://support.upverter.com/customer/portal/articles/978783-what-is-a-footprint-packing-level","children":["solder toe","solder heel","solder side","courtyard"]}}}; FOOTPRINT_URL: https://www.diodes.com/assets/Package-Files/SOD123.pdf; FOOTPRINT_VARIANT_NAME_0: Recommended_Land_Pattern; FOOTPRINT_VARIANT_NAME_1: IPC_A; FOOTPRINT_VARIANT_NAME_2: IPC_B; FOOTPRINT_VARIANT_NAME_3: IPC_C; FORWARD_CURRENT: 1A; HEIGHT: 1.45mm; IMPORTED_FROM: octopart; LEAD_FREE: Yes; MAX_JUNCTION_TEMP: +125°C; MAX_REPETITIVE_REVERSE_VOLTAGE: 40V; MAX_SURGE_FORWARD_CURRENT: 25A; MF: Diodes; MFG_PACKAGE_IDENT: SOD123; MFG_PACKAGE_IDENT_COMPONENT_ID: 38a6db40f559b91e; MFG_PACKAGE_IDENT_DATE: 03/2017; MFG_PACKAGE_IDENT_REV: 0; MOUNTING_TYPE: surface mount; MOUSER_DESCRIPTION: 1N5819HW Series 40 V 1 A Surface Mount Schottky Barrier Rectifier - SOD-123; MOUSER_PART_NUMBER: 621-1N5819HW-F; MPN: 1N5819HW-7-F; NUM_PINS: 2; OCTOPART_PART_NUMBER: e83e2130232537f9; PACKAGE: SOD123; PEAK_REVERSE_CURRENT: 1mA; PREFIX: D; REVERSE_VOLTAGE: 40V; ROHS: Yes; STANDOFF_HEIGHT: 0mm; TEMPERATURE_RANGE_HIGH: +125°C; TEMPERATURE_RANGE_LOW: -65°C; VERIFICATION_VERSION: 0.0.0.3
IC1 = TEDS-Interface:74LVC2G00: Dual-2-Input-NAND
JP1-JP4 = jumper:JP1E: JUMPER
JP5 = OASIS-Voltage-Header:PINHD-1X5: PIN HEADER
JP6 = OASIS-Debug-Header:PINHD-1X7: PIN HEADER
L1 = Bourns - SRR1260-470M:BOURNS_SRR1260-470M: 47µH Shielded Wirewound Inductor 2.6A 86 mOhm Max Nonstandard; CENTROID_NOT_SPECIFIED: No; DATASHEET: http://www.bourns.com/docs/Product-Datasheets/SRR1260.pdf; DIGIKEY_DESCRIPTION: IND FIXED IND 47UH 2.6A 86 MOHM SMD; DIGIKEY_PART_NUMBER: SRR1260-470MCT-ND; INDUCTANCE: 47µH; LEAD_FREE: yes; MF: Bourns; MFG_PACKAGE_IDENT: SRR1260; MOUSER_PART_NUMBER: 652-SRR1260-470M; MPN: SRR1260-470M; PACKAGE: SMT_INDUCTOR_12MM5_12MM5; PREFIX: L; ROHS: yes; TEMPERATURE_RANGE_HIGH: +125°C; TEMPERATURE_RANGE_LOW: -40°C
LS1 = TDK - PS1420P02CT:TDK_PS1420P02CT: Piezoelectric Buzzers; CENTROID_NOT_SPECIFIED: No; DATASHEET: https://upverter.com/datasheet/458958daf548c3d54cf9a7d1ea1ff395e223655a.pdf; DIGIKEY_DESCRIPTION: SPEAK AUDIO PIEZO TRANSDUCER 30V TH; DIGIKEY_PART_NUMBER: 445-2526-1-ND; IPC_LAND_PATTERN_NAME: CAPRD500W80D1400H1100; LEAD_FREE: yes; MF: TDK; MOUSER_PART_NUMBER: 810-PS1420P02CT; MPN: PS1420P02CT; PACKAGE: PTH_BZ; PREFIX: LS; ROHS: yes; TEMPERATURE_RANGE_HIGH: +70°C; TEMPERATURE_RANGE_LOW: -10°C
NVO = ICL7660CBAZ:ICL7660CBAZ: CMOS VOLTAGE CONVERTER Check availability <https://pricing.snapeda.com/parts/ICL7660CBAZ/Renesas%20Electronics%20America%20Inc/view-part?ref=eda>; AVAILABILITY: In Stock; DESCRIPTION: Charge Pump Switching Regulator IC Positive or Negative Fixed -Vin, 2Vin 1 Output 45mA 8-SOIC (0.154, 3.90mm Width); MF: Renesas Electronics America Inc; MP: ICL7660CBAZ; PACKAGE: SOIC-8 Renesas Electronics America Inc; PRICE: None; PURCHASE-URL: https://pricing.snapeda.com/search/part/ICL7660CBAZ/?ref=eda
OS_0 OS_1 OS_2 = jumper:JP2E: JUMPER
PEXP = PCA9554AD_118:PCA9554AD,118: 8-bit I2C-bus and SMBus I/O port with interrupt Check availability <https://pricing.snapeda.com/parts/PCA9554AD%2C118/NXP%20Semiconductors/view-part?ref=eda>; AVAILABILITY: In Stock; DESCRIPTION: I/O Expander 8 I²C, SMBus 400 kHz 16-SO; MF: NXP Semiconductors; MP: PCA9554AD,118; PACKAGE: SOIC-16 NXP Semiconductors; PRICE: None; PURCHASE-URL: https://pricing.snapeda.com/search/part/PCA9554AD,118/?ref=eda
R1-R3 R7 R8 R11-R17 R20 R22 R24-R28 RPD RPD1-RPD3 = rcl:R-EU_: RESISTOR, European symbol; SPICEPREFIX: R
R4-R6 R9 R10 = TEDS-Interface:R-EU_: RESISTOR, European symbol
R19 R21 R23 R37 = pot:TRIM_EU-: POTENTIOMETER
STATUS WLAN = WS2812B:WS2812B: Check availability <https://pricing.snapeda.com/parts/WS2812B/Worldsemi/view-part?ref=eda>; AVAILABILITY: Not in stock; DESCRIPTION: Raspberry Pi HAT (40 pin) Wheeled Robotics Kit; MF: Worldsemi; MP: WS2812B; PACKAGE: None; PRICE: None
SV1 = OASIS-CC1101-Header:MA08-1: PIN HEADER; OC_FARNELL: unknown; OC_NEWARK: unknown
SW1-SW4 = Analog Devices - ADG419BRMZ:ANALOG_DEVICES_ADG419BRMZ: ADI-ADG419-RM-8; CIIVA_IDS: 981425; CODE__JEDEC: MO-187-AA; COMPONENT_LINK_1_DESCRIPTION: Manufacturer URL; COMPONENT_LINK_1_URL: http://www.analog.com/en/index.html; COMPONENT_LINK_3_DESCRIPTION: Package Specification; COMPONENT_LINK_3_URL: http://www.analog.com/static/imported-files/packages/PKG_PDF/MSOP%28RM%29/RM_8.pdf; CONFIGURATION: SPDT; DATASHEET: http://www.analog.com/static/imported-files/data_sheets/ADG419.pdf; DATASHEET_VERSION: Rev. C; FOOTPRINT_VARIANT_NAME_0: Level C; FOOTPRINT_VARIANT_NAME_1: Level B; FOOTPRINT_VARIANT_NAME_2: Level A; IMPORTED: yes; IMPORTED_FROM: vault; IMPORT_TS: 1521848727; MAX_NEG_SUPPLY: -16.5V; MAX_POS_SUPPLY: +16.5V; MF: Analog Devices; MOUNTING_TECHNOLOGY: Surface Mount; MPN: ADG419BRMZ; PACKAGE: RM-8; PACKAGE_DESCRIPTION: 8-Pin Mini Small Outline Package, Body 3 x 3 mm, Pitch 0.65 mm; PACKAGE_VERSION: Aug-05; PACKING: Tube; PREFIX: U; RELEASE_DATE: 1391088985; RON_OHMS: 25, 40; SW_FUNCTIONS: 1; VAULT_GUID: 5B6078F7-42DE-4A85-9C26-A3C64BDE6B87; VAULT_REVISION: 4085DDB2-24DD-40A1-BE09-DD11A02FFC17
T1 T5 = OASIS-TEDS-MOSFETS:BSS84: P-CHANNEL MOS FET
T3 = transistor:*-NPN-: NPN Transistror BF959 corrected 2008.03.06
T7 T8 = OASIS-TEDS-MOSFETS:BSS123: N-CHANNEL MOS FET
U2 = SparkFun-IC-Power:MC34063: Jellybean switching supply controller (IC-11612, also SF)
U4 = ESP32-DEVKITC-32D:ESP32-DEVKITC-32D: Eval Board For Esp-Wroom-32 Check availability <https://pricing.snapeda.com/parts/ESP32-DEVKITC-32D/Espressif%20Systems/view-part?ref=eda>; AVAILABILITY: In Stock; DESCRIPTION: WiFi Development Tools (802.11) ESP32 General Development Kit, ESP32-WROOM-32D on the board; MF: Espressif Systems; MP: ESP32-DEVKITC-32D; PACKAGE: None; PRICE: None; PURCHASE-URL: https://pricing.snapeda.com/search/part/ESP32-DEVKITC-32D/?ref=eda
U5-U8 = Analog Devices Inc - LT3092IST#PBF:ANALOG_DEVICES_INC_LT3092IST#PBF: Current Source Regulator 200mA SOT-223-3; AUTOMOTIVE: No; CENTROID_NOT_SPECIFIED: No; DATASHEET: https://www.analog.com/media/en/technical-documentation/data-sheets/3092fc.pdf; DEVICE_CLASS_L1: Integrated Circuits (ICs); DEVICE_CLASS_L2: Power Management ICs; DEVICE_CLASS_L3: unset; DIGIKEY_DESCRIPTION: IC PROG CUR SOURCE SOT223; DIGIKEY_PART_NUMBER: LT3092IST#PBF-ND; FOOTPRINT_PARAMETERS_1: {"fp_type":"SOT223","params":{"N":{"default":"4","long name":"Number of leads","type":"multichoice","short name":"N"},"A":{"nom":false,"long name":"Height","min":false,"max":1800000,"short name":"A","type":"measurement"},"A1":{"nom":60950,"long name":"Standoff height","min":20300,"max":101600,"short name":"A1","type":"measurement"},"A2":{"nom":false,"long name":"Package height","min":false,"max":1779700,"short name":"A2","type":"measurement"},"D":{"nom":6505000,"long name":"Package length","min":6300000,"max":6710000,"short name":"D","type":"measurement"},"E":{"nom":7000000,"long name":"Width /w leads","min":6700000,"max":7300000,"short name":"E","type":"measurement"},"E1":{"nom":3505000,"long name":"Package width","min":3300000,"max":3710000,"short name":"E1","type":"measurement"},"B":{"nom":720000,"long name":"Lead width","min":600000,"max":840000,"short name":"B","type":"measurement"},"B2":{"nom":3025000,"long name":"Thermal lead width","min":2900000,"max":3150000,"short name":"B2","type":"measurement"},"C":{"nom":305000,"long name":"Lead thickness","min":250000,"max":360000,"short name":"C","type":"measurement"},"L":{"nom":false,"long name":"Lead foot length","min":310000,"max":false,"short name":"L","type":"measurement"},"e":{"nom":2300000,"long name":"Lead pitch","min":null,"max":null,"short name":"e","type":"measurement"},"PHI":{"nom":5000000,"long name":"Lead angle","min":0,"max":10000000,"short name":"PHI","type":"measurement"},"offset x":{"nom":0,"long name":"X Center offset","min":null,"max":null,"short name":"offset x","type":"measurement"},"offset y":{"nom":0,"long name":"Y Center offset","min":null,"max":null,"short name":"offset y","type":"measurement"},"LS":{"default":"Rounded rectangle","long name":"Land shape","type":"multichoice","short name":"LS"},"LS1":{"default":"Rectangle","long name":"Land shape (Pin 1)","type":"multichoice","short name":"LS1"},"solder toe":{"nom":550000,"long name":"Solder fillet (toe)","min":null,"max":null,"short name":"solder toe","type":"fixedmeasurement"},"solder heel":{"nom":450000,"long name":"Solder fillet (heel)","min":null,"max":null,"short name":"solder heel","type":"fixedmeasurement"},"solder side":{"nom":50000,"long name":"Solder fillet (side)","min":null,"max":null,"short name":"solder side","type":"fixedmeasurement"},"courtyard":{"nom":500000,"long name":"Courtyard","min":null,"max":null,"short name":"courtyard","type":"fixedmeasurement"},"SF":{"default":"A","long name":"Packing level","type":"multichoiceparent","short name":"SF","help":"http://support.upverter.com/customer/portal/articles/978783-what-is-a-footprint-packing-level","children":["solder toe","solder heel","solder side","courtyard"]}}}; FOOTPRINT_PARAMETERS_2: {"fp_type":"SOT223","params":{"N":{"default":"4","long name":"Number of leads","type":"multichoice","short name":"N"},"A":{"nom":false,"long name":"Height","min":false,"max":1800000,"short name":"A","type":"measurement"},"A1":{"nom":60950,"long name":"Standoff height","min":20300,"max":101600,"short name":"A1","type":"measurement"},"A2":{"nom":false,"long name":"Package height","min":false,"max":1779700,"short name":"A2","type":"measurement"},"D":{"nom":6505000,"long name":"Package length","min":6300000,"max":6710000,"short name":"D","type":"measurement"},"E":{"nom":7000000,"long name":"Width /w leads","min":6700000,"max":7300000,"short name":"E","type":"measurement"},"E1":{"nom":3505000,"long name":"Package width","min":3300000,"max":3710000,"short name":"E1","type":"measurement"},"B":{"nom":720000,"long name":"Lead width","min":600000,"max":840000,"short name":"B","type":"measurement"},"B2":{"nom":3025000,"long name":"Thermal lead width","min":2900000,"max":3150000,"short name":"B2","type":"measurement"},"C":{"nom":305000,"long name":"Lead thickness","min":250000,"max":360000,"short name":"C","type":"measurement"},"L":{"nom":false,"long name":"Lead foot length","min":310000,"max":false,"short name":"L","type":"measurement"},"e":{"nom":2300000,"long name":"Lead pitch","min":null,"max":null,"short name":"e","type":"measurement"},"PHI":{"nom":5000000,"long name":"Lead angle","min":0,"max":10000000,"short name":"PHI","type":"measurement"},"offset x":{"nom":0,"long name":"X Center offset","min":null,"max":null,"short name":"offset x","type":"measurement"},"offset y":{"nom":0,"long name":"Y Center offset","min":null,"max":null,"short name":"offset y","type":"measurement"},"LS":{"default":"Rounded rectangle","long name":"Land shape","type":"multichoice","short name":"LS"},"LS1":{"default":"Rectangle","long name":"Land shape (Pin 1)","type":"multichoice","short name":"LS1"},"solder toe":{"nom":350000,"long name":"Solder fillet (toe)","min":null,"max":null,"short name":"solder toe","type":"fixedmeasurement"},"solder heel":{"nom":350000,"long name":"Solder fillet (heel)","min":null,"max":null,"short name":"solder heel","type":"fixedmeasurement"},"solder side":{"nom":30000,"long name":"Solder fillet (side)","min":null,"max":null,"short name":"solder side","type":"fixedmeasurement"},"courtyard":{"nom":250000,"long name":"Courtyard","min":null,"max":null,"short name":"courtyard","type":"fixedmeasurement"},"SF":{"default":"B","long name":"Packing level","type":"multichoiceparent","short name":"SF","help":"http://support.upverter.com/customer/portal/articles/978783-what-is-a-footprint-packing-level","children":["solder toe","solder heel","solder side","courtyard"]}}}; FOOTPRINT_PARAMETERS_3: {"fp_type":"SOT223","params":{"N":{"default":"4","long name":"Number of leads","type":"multichoice","short name":"N"},"A":{"nom":false,"long name":"Height","min":false,"max":1800000,"short name":"A","type":"measurement"},"A1":{"nom":60950,"long name":"Standoff height","min":20300,"max":101600,"short name":"A1","type":"measurement"},"A2":{"nom":false,"long name":"Package height","min":false,"max":1779700,"short name":"A2","type":"measurement"},"D":{"nom":6505000,"long name":"Package length","min":6300000,"max":6710000,"short name":"D","type":"measurement"},"E":{"nom":7000000,"long name":"Width /w leads","min":6700000,"max":7300000,"short name":"E","type":"measurement"},"E1":{"nom":3505000,"long name":"Package width","min":3300000,"max":3710000,"short name":"E1","type":"measurement"},"B":{"nom":720000,"long name":"Lead width","min":600000,"max":840000,"short name":"B","type":"measurement"},"B2":{"nom":3025000,"long name":"Thermal lead width","min":2900000,"max":3150000,"short name":"B2","type":"measurement"},"C":{"nom":305000,"long name":"Lead thickness","min":250000,"max":360000,"short name":"C","type":"measurement"},"L":{"nom":false,"long name":"Lead foot length","min":310000,"max":false,"short name":"L","type":"measurement"},"e":{"nom":2300000,"long name":"Lead pitch","min":null,"max":null,"short name":"e","type":"measurement"},"PHI":{"nom":5000000,"long name":"Lead angle","min":0,"max":10000000,"short name":"PHI","type":"measurement"},"offset x":{"nom":0,"long name":"X Center offset","min":null,"max":null,"short name":"offset x","type":"measurement"},"offset y":{"nom":0,"long name":"Y Center offset","min":null,"max":null,"short name":"offset y","type":"measurement"},"LS":{"default":"Rounded rectangle","long name":"Land shape","type":"multichoice","short name":"LS"},"LS1":{"default":"Rectangle","long name":"Land shape (Pin 1)","type":"multichoice","short name":"LS1"},"solder toe":{"nom":150000,"long name":"Solder fillet (toe)","min":null,"max":null,"short name":"solder toe","type":"fixedmeasurement"},"solder heel":{"nom":250000,"long name":"Solder fillet (heel)","min":null,"max":null,"short name":"solder heel","type":"fixedmeasurement"},"solder side":{"nom":10000,"long name":"Solder fillet (side)","min":null,"max":null,"short name":"solder side","type":"fixedmeasurement"},"courtyard":{"nom":100000,"long name":"Courtyard","min":null,"max":null,"short name":"courtyard","type":"fixedmeasurement"},"SF":{"default":"C","long name":"Packing level","type":"multichoiceparent","short name":"SF","help":"http://support.upverter.com/customer/portal/articles/978783-what-is-a-footprint-packing-level","children":["solder toe","solder heel","solder side","courtyard"]}}}; FOOTPRINT_URL: https://www.analog.com/media/en/package-pcb-resources/package/pkg_pdf/ltc-legacy-sot-223/SOT_3_05-08-1630.pdf; FOOTPRINT_VARIANT_NAME_0: Recommended_Land_Pattern; FOOTPRINT_VARIANT_NAME_1: IPC_A; FOOTPRINT_VARIANT_NAME_2: IPC_B; FOOTPRINT_VARIANT_NAME_3: IPC_C; HEIGHT: 1.8mm; IPC_LAND_PATTERN_NAME: SOT230P700X180-4; LEAD_FREE: Yes; MAX_JUNCTION_TEMP: +125°C; MAX_SUPPLY_VOLTAGE: 40V; MF: Analog Devices Inc; MFG_PACKAGE_IDENT: ST-3-05-08-1630; MFG_PACKAGE_IDENT_COMPONENT_ID: b6bea528bdfa272a; MFG_PACKAGE_IDENT_DATE: 0; MFG_PACKAGE_IDENT_REV: 0; MIN_SUPPLY_VOLTAGE: 1.2V; MOUSER_PART_NUMBER: 584-LT3092IST#PBF; MPN: LT3092IST#PBF; NUMBER_OF_OUTPUTS: 1; OUTPUT_CURRENT: 200mA; PACKAGE: SOT-223-3; PREFIX: U; ROHS: Yes; STANDOFF_HEIGHT: 0.0203mm; TEMPERATURE_RANGE_HIGH: +125°C; TEMPERATURE_RANGE_LOW: -40°C; VERIFICATION_VERSION: 0.0.0.3
U$1 = TEDS-Interface:TMUX1119: 1-Kanal Umschalter 5V
WSS_LED XLED1-XLED4 = SparkFun-LED:LED: LED (Generic) Standard schematic elements and footprints for 5mm, 3mm, 1206, and 0603 sized LEDs. Generic LEDs with no color specified.
X1-X4 = OWN_DEVICES:BNC

## Net classes
1 gnd: width 0.254 mm, drill 0.254 mm, clearance 0.178 mm